# Altium schematic sheet [6] TSAL.SchDoc
size A4; DocumentNumber: 8; SheetNumber: 9; SheetTotal: 10
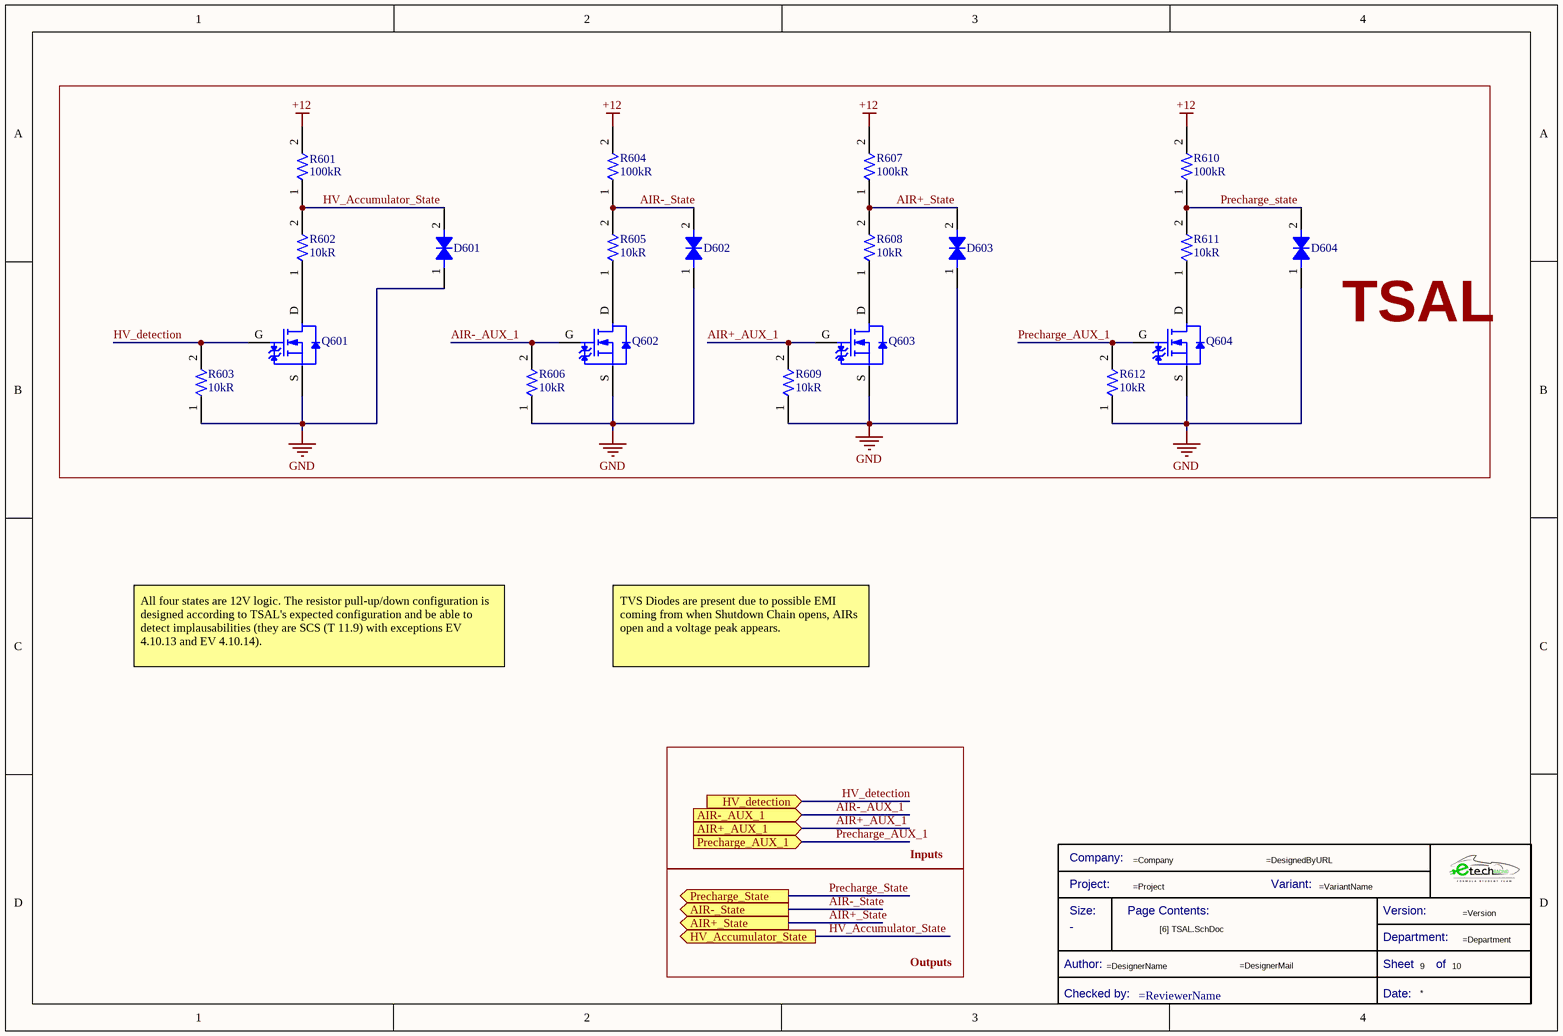
[diagram p0: [6] TSAL.SchDoc]

## Parts
*?  Title Block_template  (value not drawn)  (graphical)
D601  824501131  [DTVS-DO-214AC]  (value not drawn)
D602  824501131  [DTVS-DO-214AC]  (value not drawn)
D603  824501131  [DTVS-DO-214AC]  (value not drawn)
D604  824501131  [DTVS-DO-214AC]  (value not drawn)
Q601  CPH3455-TL-H  [TRT-NCH-3/35-CPH]  (value not drawn)
Q602  CPH3455-TL-H  [TRT-NCH-3/35-CPH]  (value not drawn)
Q603  CPH3455-TL-H  [TRT-NCH-3/35-CPH]  (value not drawn)
Q604  CPH3455-TL-H  [TRT-NCH-3/35-CPH]  (value not drawn)
R601  Resistance: 100kR  [R0805FTK]  (hidden comment: CR0805-JW-103ELF)
R602  Resistance: 10kR  [R0805FTK]  (hidden comment: CR0805-JW-103ELF)
R603  Resistance: 10kR  [R0805FTK]  (hidden comment: CR0805-JW-103ELF)
R604  Resistance: 100kR  [R0805FTK]  (hidden comment: CR0805-JW-103ELF)
R605  Resistance: 10kR  [R0805FTK]  (hidden comment: CR0805-JW-103ELF)
R606  Resistance: 10kR  [R0805FTK]  (hidden comment: CR0805-JW-103ELF)
R607  Resistance: 100kR  [R0805FTK]  (hidden comment: CR0805-JW-103ELF)
R608  Resistance: 10kR  [R0805FTK]  (hidden comment: CR0805-JW-103ELF)
R609  Resistance: 10kR  [R0805FTK]  (hidden comment: CR0805-JW-103ELF)
R610  Resistance: 100kR  [R0805FTK]  (hidden comment: CR0805-JW-103ELF)
R611  Resistance: 10kR  [R0805FTK]  (hidden comment: CR0805-JW-103ELF)
R612  Resistance: 10kR  [R0805FTK]  (hidden comment: CR0805-JW-103ELF)

## Blocks framed on the sheet
TSAL: D601-D604 Q601-Q604 R601-R612

## Ports
AIR+_AUX_1 (in), AIR+_State (out), AIR-_AUX_1 (in), AIR-_State (out), HV_Accumulator_State (out), HV_detection (in), Precharge_AUX_1 (in), Precharge_State (out)

## Nets
+12: R601.2 R604.2 R607.2 R610.2
GND: D601.1 D602.1 D603.1 D604.1 Q601.S Q602.S Q603.S Q604.S R603.1 R606.1 R609.1 R612.1
AIR+_AUX_1: Q603.G R609.2 ; port AIR+_AUX_1
AIR+_State: D603.2 R607.1 R608.2 ; port AIR+_State
AIR-_AUX_1: Q602.G R606.2 ; port AIR-_AUX_1
AIR-_State: D602.2 R604.1 R605.2 ; port AIR-_State
HV_Accumulator_State: D601.2 R601.1 R602.2 ; port HV_Accumulator_State
HV_detection: Q601.G R603.2 ; port HV_detection
Precharge_AUX_1: Q604.G R612.2 ; port Precharge_AUX_1
Precharge_State: D604.2 R610.1 R611.2 ; port Precharge_State
NetQ601_D: Q601.D R602.1
NetQ602_D: Q602.D R605.1
NetQ603_D: Q603.D R608.1
NetQ604_D: Q604.D R611.1

## Notes on the sheet
- All four states are 12V logic. The resistor pull-up/down configuration is designed according to TSAL's expected configuration and be able to detect implausabilities (they are SCS (T 11.9) with exceptions EV 4.10.13 and EV 4.10.14).
- TVS Diodes are present due to possible EMI coming from when Shutdown Chain opens, AIRs open and a voltage peak appears.
- Inputs
- Outputs
- (in symbol Title Block_template) Company:; Project:; Variant:; Size:; Page Contents:; Version:; Department:; Author:; Sheet; of; Checked by:; Date:

## Library data of the parts
*? = Title Block_template: Standard Title Block; Category: Title Block; Checked by:: =ReviewerName; Size: -
D601-D604 = DTVS-13V-DO-214AC: Tvs Diode, 400W, 13V, Bidir, DO-214AC; Manufacturer: Wurth Electronics; Number of Bidirectional Channels: 1; Min Breakdown Voltage: 15.15V; Clamping Voltage: 21.5V; Power Line Protection: No; Polarity: Bidirectional; Peak Pulse Current: 18.6A; .Creator: DO; Supplier 1: Digi-Key; Manufacturer Part Number: 824501131; RoHS: Yes; Category: TVS Diodes; Stock 1: 1000; Pricing 1: 1=0,27000 (USD); Mount: Surface Mount; Number of Pins: 2; Min Operating Temperature: -65°C; Max Operating Temperature: 150°C; Packaging: Cut Tape; Reverse Standoff Voltage: 13V; Peak Pulse Power: 400W; Max Breakdown Voltage: 15.15V; Resistor Type: Zener; REACH SVHC: Unknown; RoHS Compliant: Yes; ComponentLink1URL: https://katalog.we-online.de/pbs/datasheet/824501131.pdf?src-supplier=Digi-Key; ComponentLink1Description: https://katalog.we-online.de/pbs/datasheet/824501131.pdf?src-supplier=Digi-Key; ComponentLink2URL: http://www.farnell.com/datasheets/2036399.pdf?src-supplier=Element14; ComponentLink2Description: http://www.farnell.com/datasheets/2036399.pdf?src-supplier=Element14; ComponentLink3Description: Where buy it; ComponentLink3URL: https://www.we-online.com/catalog/en/WE-TVSP?sq=824501131#824501131; Supplier Part Number 1: 732-824501131CT-ND
Q601-Q604 = TRT-NCH-3/35-CPH: CPH3455-TL-H N-channel MOSFET Transistor; 3 A; 35 V; 3-Pin CPH; Manufacturer: ON Semiconductor; Rds On Max: 104mR; Input Capacitance: 186pF; Rise Time: 4.7ns; Drain to Source Voltage (Vdss): 35V; Continuous Drain Current (ID): 3A; Max Power Dissipation: 1W; Drain to Source Resistance: 108mR; Turn-On Delay Time: 4.2ns; Turn-Off Delay Time: 15ns; Fall Time: 5.7ns; Element Configuration: Single; Gate to Source Voltage (Vgs): 20V; .Creator: GP; Category: Transistor; ComponentLink1Description: Datasheet; ComponentLink1URL: https://docs.rs-online.com/5847/0900766b812d514d.pdf; ComponentLink2Description: Where buy it; ComponentLink2URL: https://es.rs-online.com/web/p/mosfet/8009989; Supplier 1: RSComponents; Manufacturer Part Number: CPH3455-TL-H; RoHS: Yes; Stock 1: 1; Pricing 1: 50=0,50400 (USD); Case/Package: SC; Number of Pins: 3; Min Operating Temperature: -55°C; Max Operating Temperature: 150°C; Package Quantity: 3000; Packaging: Tape and Reel; Drain to Source Breakdown Voltage: 35V; Power Dissipation: 1W; Polarity: N-CHANNEL; Series: -; Length: 2.9mm; Width: 1.6mm; Height: 0.9mm; Lead Free: Lead Free; Halogen Free: Halogen Free; RoHS Compliant: Yes; ComponentLink3URL: https://datasheet.ciiva.com/947/cph3455-d-947201.pdf?src-supplier=Digi-Key; ComponentLink3Description: https://datasheet.ciiva.com/947/cph3455-d-947201.pdf?src-supplier=Digi-Key; ComponentLink4URL: https://datasheet.ciiva.com/4444/cph3455-d-91653-4444616.pdf?src-supplier=Mouser; ComponentLink4Description: https://datasheet.ciiva.com/4444/cph3455-d-91653-4444616.pdf?src-supplier=Mouser; ComponentLink5URL: https://datasheet.ciiva.com/11164/cph3455-d-11164889.pdf?src-supplier=Avnet; ComponentLink5Description: https://datasheet.ciiva.com/11164/cph3455-d-11164889.pdf?src-supplier=Avnet; Supplier Part Number 1: 8009989
R601-R612 = R10k-0805FTK: BOURNS         CR0805-JW-103ELF            Surface Mount Chip Resistor, Thick Film, CR Series, 10 kohm, 125 mW,  5%, 150 V; Temperature Coefficient: 200ppm/°C; Power Rating: 125mW; Voltage Rating: 150V; Voltage Rating (DC): 100V; .Creator: DR; Supplier 1: Arrow Electronics; Manufacturer 1: Bourns; Manufacturer Part Number 1: CR0805-JW-103ELF; RoHS: Yes; Category: Chip SMD Resistors; Stock 1: 57566; Pricing 1: 1=0,05790, 10=0,01540, 25=0,01340, 100=0,00340 (USD); Mount: Surface Mount; Case/Package: 0805; Number of Pins: 2; Contact Plating: Tin; Case Code (Metric): 2012; Case Code (Imperial): 0805; Min Operating Temperature: -55°C; Max Operating Temperature: 155°C; Tolerance: 5%; Resistor Type: Thick Film; Package Quantity: 1; Packaging: Tape and Reel; Number of Terminations: 2; Termination: SMD/SMT; Max Power Dissipation: 125mW; Features: Moisture Resistant; Series: CR0805; Construction: Rectangular; Resistance Tolerance: 5%; Technology: THICK FILM; Length: 2mm; Width: 1.25mm; Height: 0.5mm; Depth: 1.25mm; Thickness: 508um; Radiation Hardening: No; REACH SVHC: No SVHC; Military Standard: Not; RoHS Compliant: Yes; ComponentLink1URL: https://datasheet.ciiva.com/11821/0900766b80fcdb72-11821135.pdf?src-supplier=RSComponents; ComponentLink1Description: https://datasheet.ciiva.com/11821/0900766b80fcdb72-11821135.pdf?src-supplier=RSComponents; ComponentLink2URL: https://datasheet.ciiva.com/9122/chpreztr-9122374.pdf?src-supplier=Avnet; ComponentLink2Description: https://datasheet.ciiva.com/9122/chpreztr-9122374.pdf?src-supplier=Avnet; ComponentLink3URL: https://datasheet.ciiva.com/22693/1902866-22693254.pdf?src-supplier=Element14; ComponentLink3Description: https://datasheet.ciiva.com/22693/1902866-22693254.pdf?src-supplier=Element14; ComponentLink4URL: https://datasheet.ciiva.com/7986/691949-7986187.pdf?src-supplier=Element14; ComponentLink4Description: https://datasheet.ciiva.com/7986/691949-7986187.pdf?src-supplier=Element14; ComponentLink5URL: https://datasheet.ciiva.com/30065/159chpreztr-30065976.pdf?src-supplier=Onlinecomponents.com; ComponentLink5Description: https://datasheet.ciiva.com/30065/159chpreztr-30065976.pdf?src-supplier=Onlinecomponents.com; ComponentLink6URL: https://datasheet.ciiva.com/16783/70154685-16783482.pdf?src-supplier=Allied+Electronics; ComponentLink6Description: https://datasheet.ciiva.com/16783/70154685-16783482.pdf?src-supplier=Allied+Electronics; ComponentLink7URL: https://datasheet.ciiva.com/5548/chpreztr-5548491.pdf?src-supplier=Mouser; ComponentLink7Description: https://datasheet.ciiva.com/5548/chpreztr-5548491.pdf?src-supplier=Mouser; ComponentLink8URL: https://datasheet.ciiva.com/6559/chpreztr-6559900.pdf?src-supplier=Digi-Key; ComponentLink8Description: https://datasheet.ciiva.com/6559/chpreztr-6559900.pdf?src-supplier=Digi-Key; ComponentLink9URL: https://datasheet.ciiva.com/6559/chpreztr-6559901.pdf?src-supplier=Digi-Key; ComponentLink9Description: https://datasheet.ciiva.com/6559/chpreztr-6559901.pdf?src-supplier=Digi-Key; ComponentLink10URL: https://datasheet.ciiva.com/7985/1856384-7985869.pdf?src-supplier=Element14; ComponentLink10Description: https://datasheet.ciiva.com/7985/1856384-7985869.pdf?src-supplier=Element14; ComponentLink11URL: https://datasheet.ciiva.com/48692/001055517-da-01-en-smd-wid-cr0805-jw-103elf-10k-ohm-1-8w-48692118.pdf?src-supplier=Conrad; ComponentLink11Description: https://datasheet.ciiva.com/48692/001055517-da-01-en-smd-wid-cr0805-jw-103elf-10k-ohm-1-8w-48692118.pdf?src-supplier=Conrad; Supplier Part Number 1: CR0805-JW-103ELF